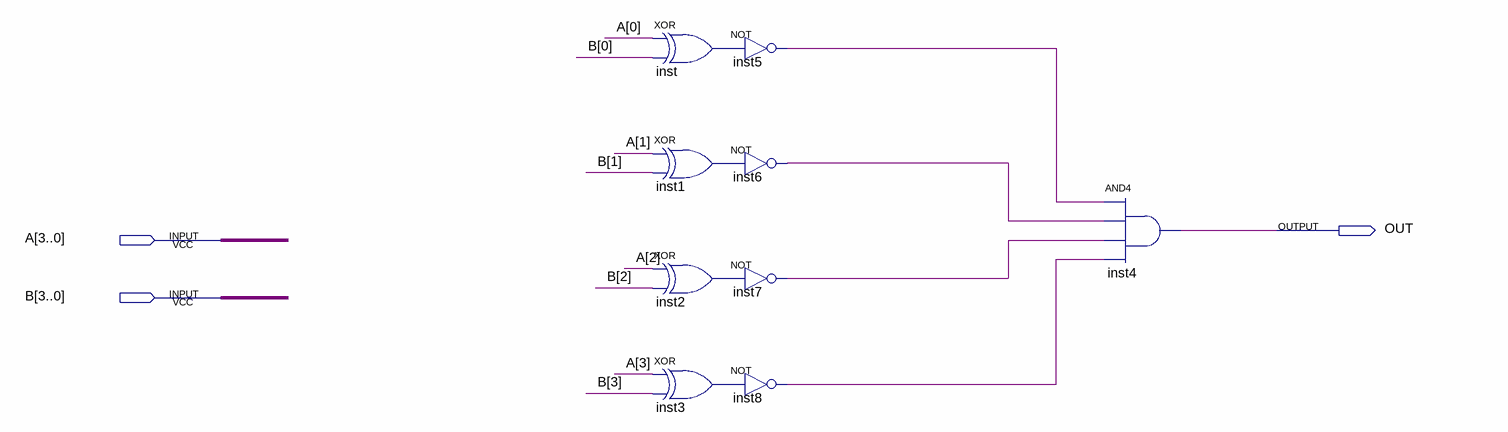
[diagram p0: schematic sheet]
// Quartus schematic FourBitComparator.bdf as structural Verilog: 9 symbols, 3 pins
module FourBitComparator (
  input  [3:0] A,
  input  [3:0] B,
  output OUT
);

  wire inst1_out, inst2_out, inst3_out, inst5_out, inst6_out, inst7_out, inst8_out, inst_out;

  xor inst (inst_out, A[0], B[0]);
  xor inst1 (inst1_out, A[1], B[1]);
  xor inst2 (inst2_out, A[2], B[2]);
  xor inst3 (inst3_out, A[3], B[3]);
  not inst5 (inst5_out, inst_out);
  not inst6 (inst6_out, inst1_out);
  not inst7 (inst7_out, inst2_out);
  not inst8 (inst8_out, inst3_out);
  and inst4 (OUT, inst5_out, inst6_out, inst7_out, inst8_out);
endmodule
